# EAGLE design MotorDriver1 (EAGLE 9.0.1)
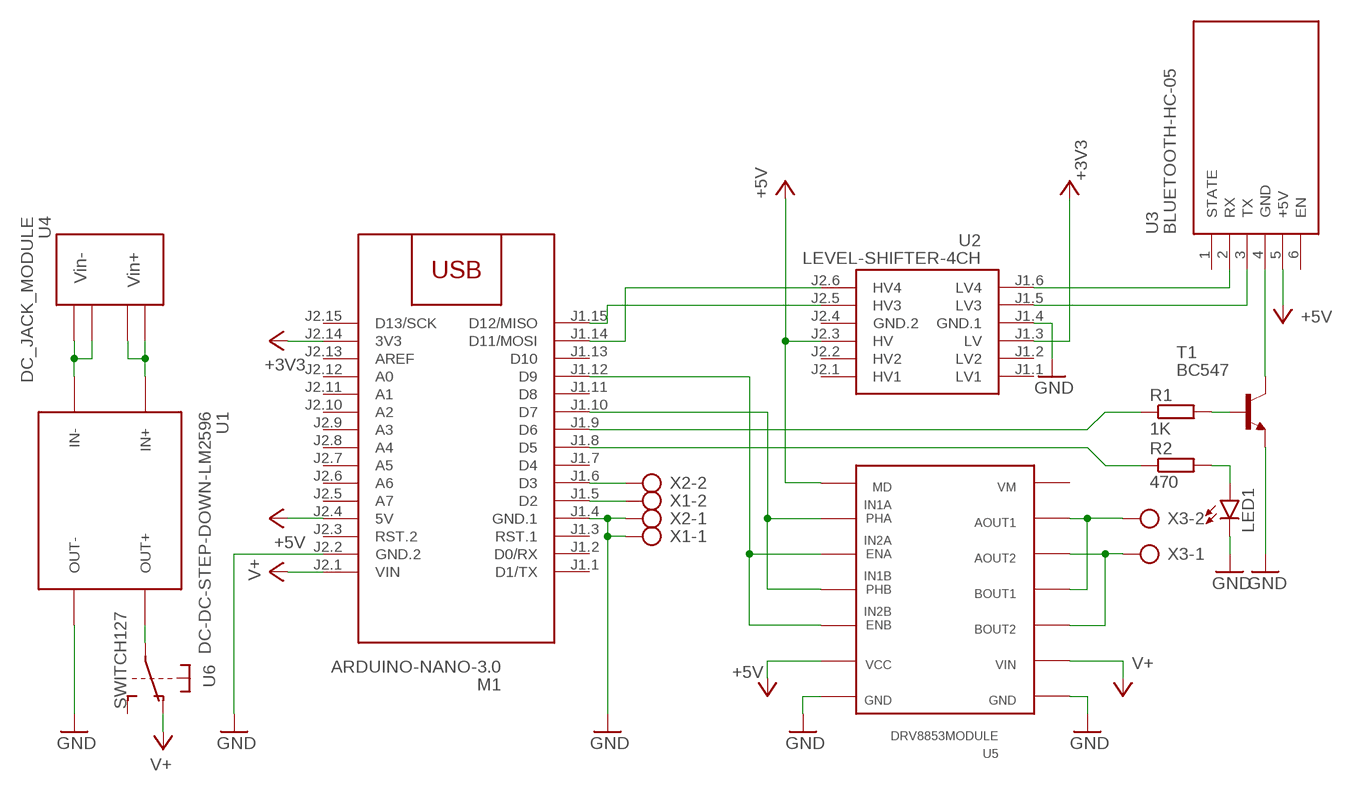
[diagram p0: schematic, sheet 1]

## Parts
LED1  LED3MM  [LED3MM]
M1  ARDUINO-NANO-3.0  [ARDUINO-NANO-3.0]
R1  1K  R-EU_0207/7  [0207/7]
R2  470  R-EU_0207/7  [0207/7]
T1  BC547  [TO92]
U1  DC-DC-STEP-DOWN-LM2596  [DC-DC-STEP-DOWN-LM2596]
U2  LEVEL-SHIFTER-4CH  [LEVEL-SHIFTER-4CH]
U3  BLUETOOTH-HC-05  WIRELESS-BLUETOOTH-HC-05  [WIRELESS-BLUETOOTH-HC-05]
U4  DC_JACK_MODULE  [MA04-1]
U5  DRV8853MODULE  [DIL14]
U6  SWITCH127  [SWITCH127]
X1  AK500/2  [AK500/2]
X2  AK500/2  [AK500/2]
X3  AK500/2  [AK500/2]

## Nets
+3V3: M1.J2.14(3V3) U2.J1.3(LV)
+5V: M1.J2.4(5V) U2.J2.3(HV) U3.5(+5V) U5.9 U5.14
GND: LED1.K(C) M1.J1.4(GND.1) M1.J2.2(GND.2) T1.1(E) U1.OUT- U2.J1.4(GND.1) U5.1 U5.8 X1.1 X2.1
N$1: U1.IN+ U4.1 U4.2
N$2: U1.IN- U4.3 U4.4
N$3: M1.J1.6(D3) X2.2
N$4: M1.J1.10(D7) U5.11 U5.13
N$5: M1.J1.12(D9) U5.10 U5.12
N$6: U5.4 U5.6 X3.2
N$7: M1.J1.5(D2) X1.2
N$8: U1.OUT+ U6.P$2
N$9: M1.J1.8(D5) R2.1
N$10: M1.J1.14(D11/MOSI) U2.J2.6(HV4)
N$11: M1.J1.15(D12/MISO) U2.J2.5(HV3)
N$12: M1.J1.9(D6) R1.1
N$13: U5.3 U5.5 X3.1
N$16: R1.2 T1.2(B)
N$17: T1.3(C) U3.4(GND)
N$19: LED1.A R2.2
N$20: U2.J1.6(LV4) U3.2(RX)
N$22: U2.J1.5(LV3) U3.3(TX)
V+: M1.J2.1(VIN) U5.2 U6.P$3
Unconnected: M1.J1.1(D1/TX) M1.J1.2(D0/RX) M1.J1.3(RST.1) M1.J1.7(D4) M1.J1.11(D8) M1.J1.13(D10) M1.J2.3(RST.2) M1.J2.5(A7) M1.J2.6(A6) M1.J2.7(A5) M1.J2.8(A4) M1.J2.9(A3) M1.J2.10(A2) M1.J2.11(A1) M1.J2.12(A0) M1.J2.13(AREF) M1.J2.15(D13/SCK) U2.J1.1(LV1) U2.J1.2(LV2) U2.J2.1(HV1) U2.J2.2(HV2) U3.1(STATE) U3.6(EN) U5.7 U6.P$1

## Power pins joined to a net without a drawn wire
GND.2: U2.J2.4(GND.2)

## Library data of the parts
LED1 = led:LED: LED OSRAM: - CHIPLED LG R971, LG N971, LY N971, LG Q971, LY Q971, LO R971, LY R971 LH N974, LH R974 LS Q976, LO Q976, LY Q976 LO Q996 - Hyper CHIPLED LW Q18S LB Q993, LB Q99A, LB R99A - SideLED LS A670, LO A670, LY A670, LG A670, LP A670 LB A673, LV A673, LT A673, LW A673 LH A674 LY A675 LS A676, LA A676, LO A676, LY A676, LW A676 LS A679, LY A679, LG A679 - Hyper Micro SIDELED® LS Y876, LA Y876, LO Y876, LY Y876 LT Y87S - SmartLED LW L88C, LW L88S LB L89C, LB L89S, LG L890 LS L89K, LO L89K, LY L89K LS L896, LA L896, LO L896, LY L896 - TOPLED LS T670, LO T670, LY T670, LG T670, LP T670 LSG T670, LSP T670, LSY T670, LOP T670, LYG T670 LG T671, LOG T671, LSG T671 LB T673, LV T673, LT T673, LW T673 LH T674 LS T676, LA T676, LO T676, LY T676, LB T676, LH T676, LSB T676, LW T676 LB T67C, LV T67C, LT T67C, LS T67K, LO T67K, LY T67K, LW E67C LS E67B, LA E67B, LO E67B, LY E67B, LB E67C, LV E67C, LT E67C LW T67C LS T679, LY T679, LG T679 LS T770, LO T770, LY T770, LG T770, LP T770 LB T773, LV T773, LT T773, LW T773 LH T774 LS E675, LA E675, LY E675, LS T675 LS T776, LA T776, LO T776, LY T776, LB T776 LHGB T686 LT T68C, LB T68C - Hyper Mini TOPLED® LB M676 - Mini TOPLED Santana® LG M470 LS M47K, LO M47K, LY M47K Source: http://www.osram.convergy.de LUXEON: - LUMILED® LXK2-PW12-R00, LXK2-PW12-S00, LXK2-PW14-U00, LXK2-PW14-V00 LXK2-PM12-R00, LXK2-PM12-S00, LXK2-PM14-U00 LXK2-PE12-Q00, LXK2-PE12-R00, LXK2-PE12-S00, LXK2-PE14-T00, LXK2-PE14-U00 LXK2-PB12-K00, LXK2-PB12-L00, LXK2-PB12-M00, LXK2-PB14-N00, LXK2-PB14-P00, LXK2-PB14-Q00 LXK2-PR12-L00, LXK2-PR12-M00, LXK2-PR14-Q00, LXK2-PR14-R00 LXK2-PD12-Q00, LXK2-PD12-R00, LXK2-PD12-S00 LXK2-PH12-R00, LXK2-PH12-S00 LXK2-PL12-P00, LXK2-PL12-Q00, LXK2-PL12-R00 Source: www.luxeon.com KINGBRIGHT: KA-3528ASYC Source: www.kingbright.com
M1 = diy-modules:ARDUINO-NANO-3.0: Arduino Nano 3.0 and compatible devices More details available here: https://www.arduino.cc/en/Main/ArduinoBoardNano Click here to find device on ebay.com <http://www.ebay.com/sch/arduino+nano>
R1 R2 = rcl:R-EU_: RESISTOR, European symbol; SPICEPREFIX: R
T1 = transistor:BC547: NPN TRANSISTOR
U1 = diy-modules:DC-DC-STEP-DOWN-LM2596: DC/DC Step-Down Regulator based on LM2596-ADJ chip LM2596 datasheet available here: http://www.ti.com/lit/ds/symlink/lm2596.pdf Click here to find device on ebay.com <http://www.ebay.com/sch/lm2596+power+regulator>
U2 = diy-modules:LEVEL-SHIFTER-4CH: 4-Channel Bi-Directional Logic Level Converter based on BSS128 transistors Click here to find device on ebay.com <http://www.ebay.com/sch/i2c+logic+converter+module>
U3 = diy-modules:WIRELESS-BLUETOOTH-HC-05: Bluetooth Transceiver Module based on HC-05 board Tutorial is available here: https://arduino-info.wikispaces.com/BlueTooth-HC05-HC06-Modules-How-To Click here to find device on ebay.com <http://www.ebay.com/sch/hc-05+module+rs232>
U4 = lib_2:DC_JACK_MODULE
U5 = lib_2:DRV8853MODULE
U6 = lib_2:SWITCH127
X1-X3 = con-ptr500:AK500/2: CONNECTOR; OC_FARNELL: unknown; OC_NEWARK: unknown

## Board
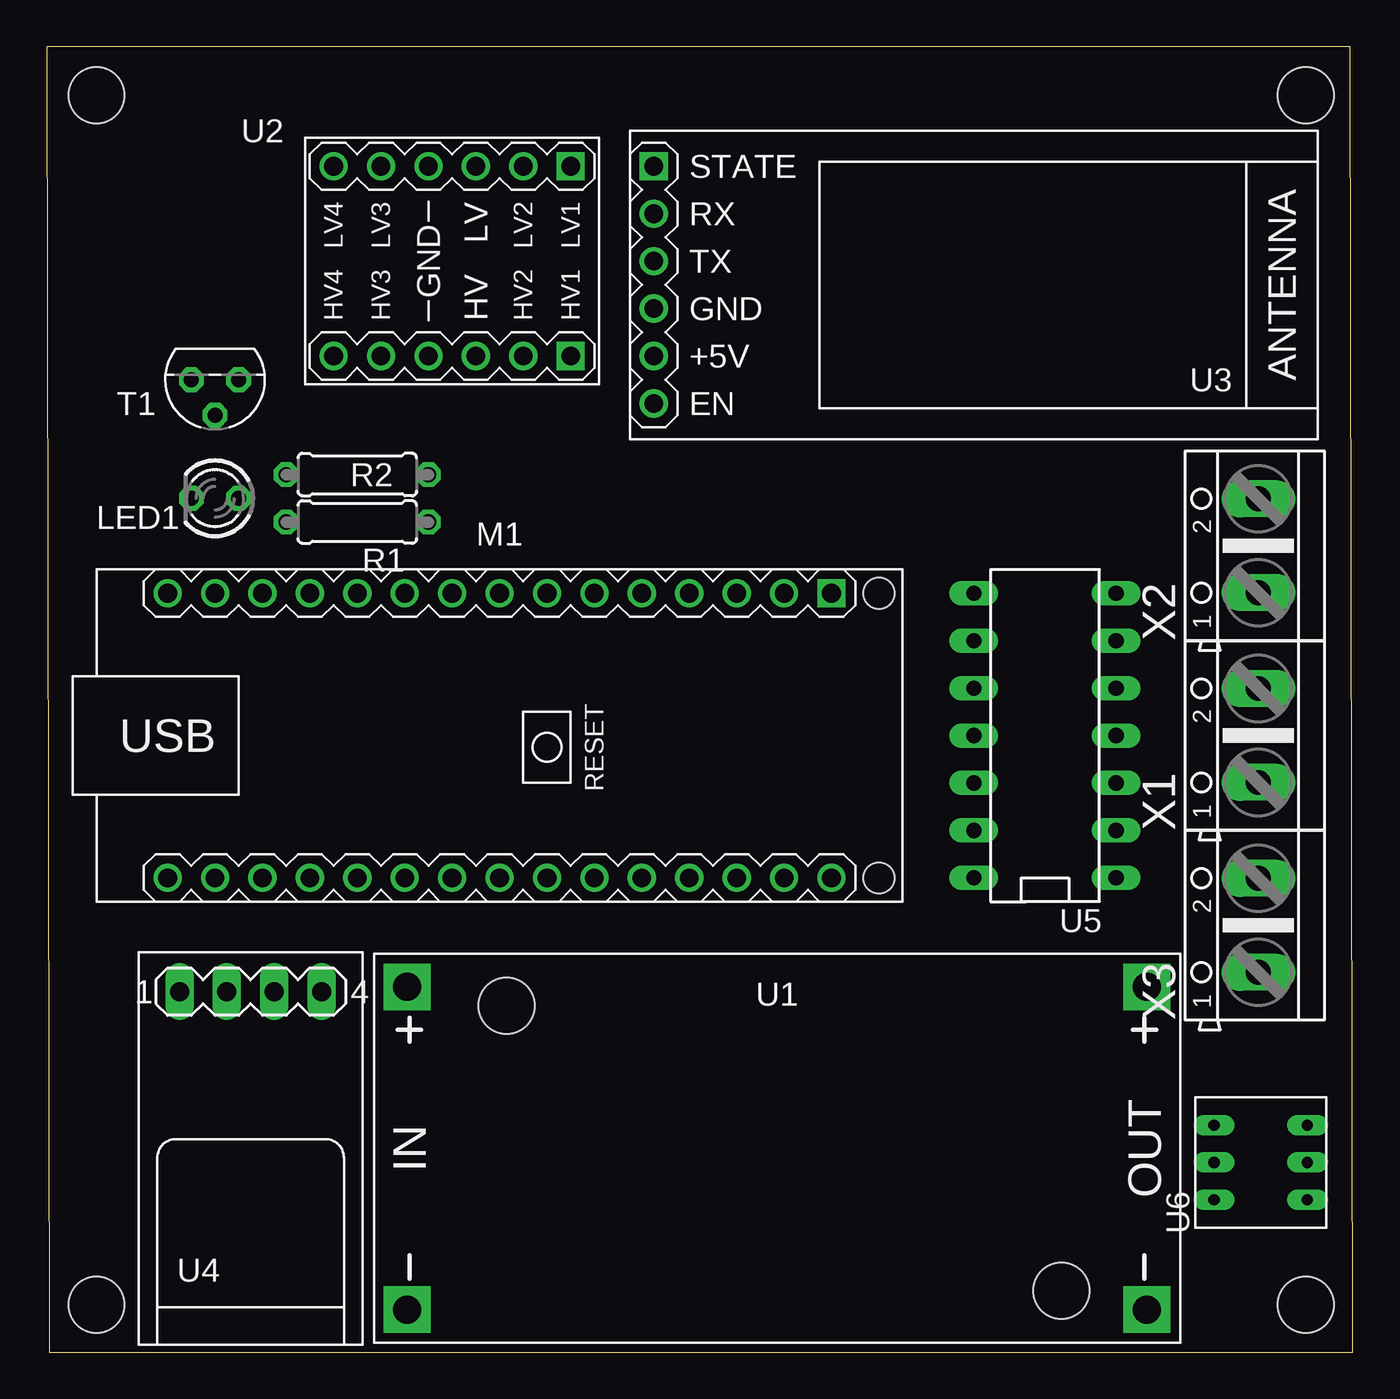
[diagram p1: board, top side]
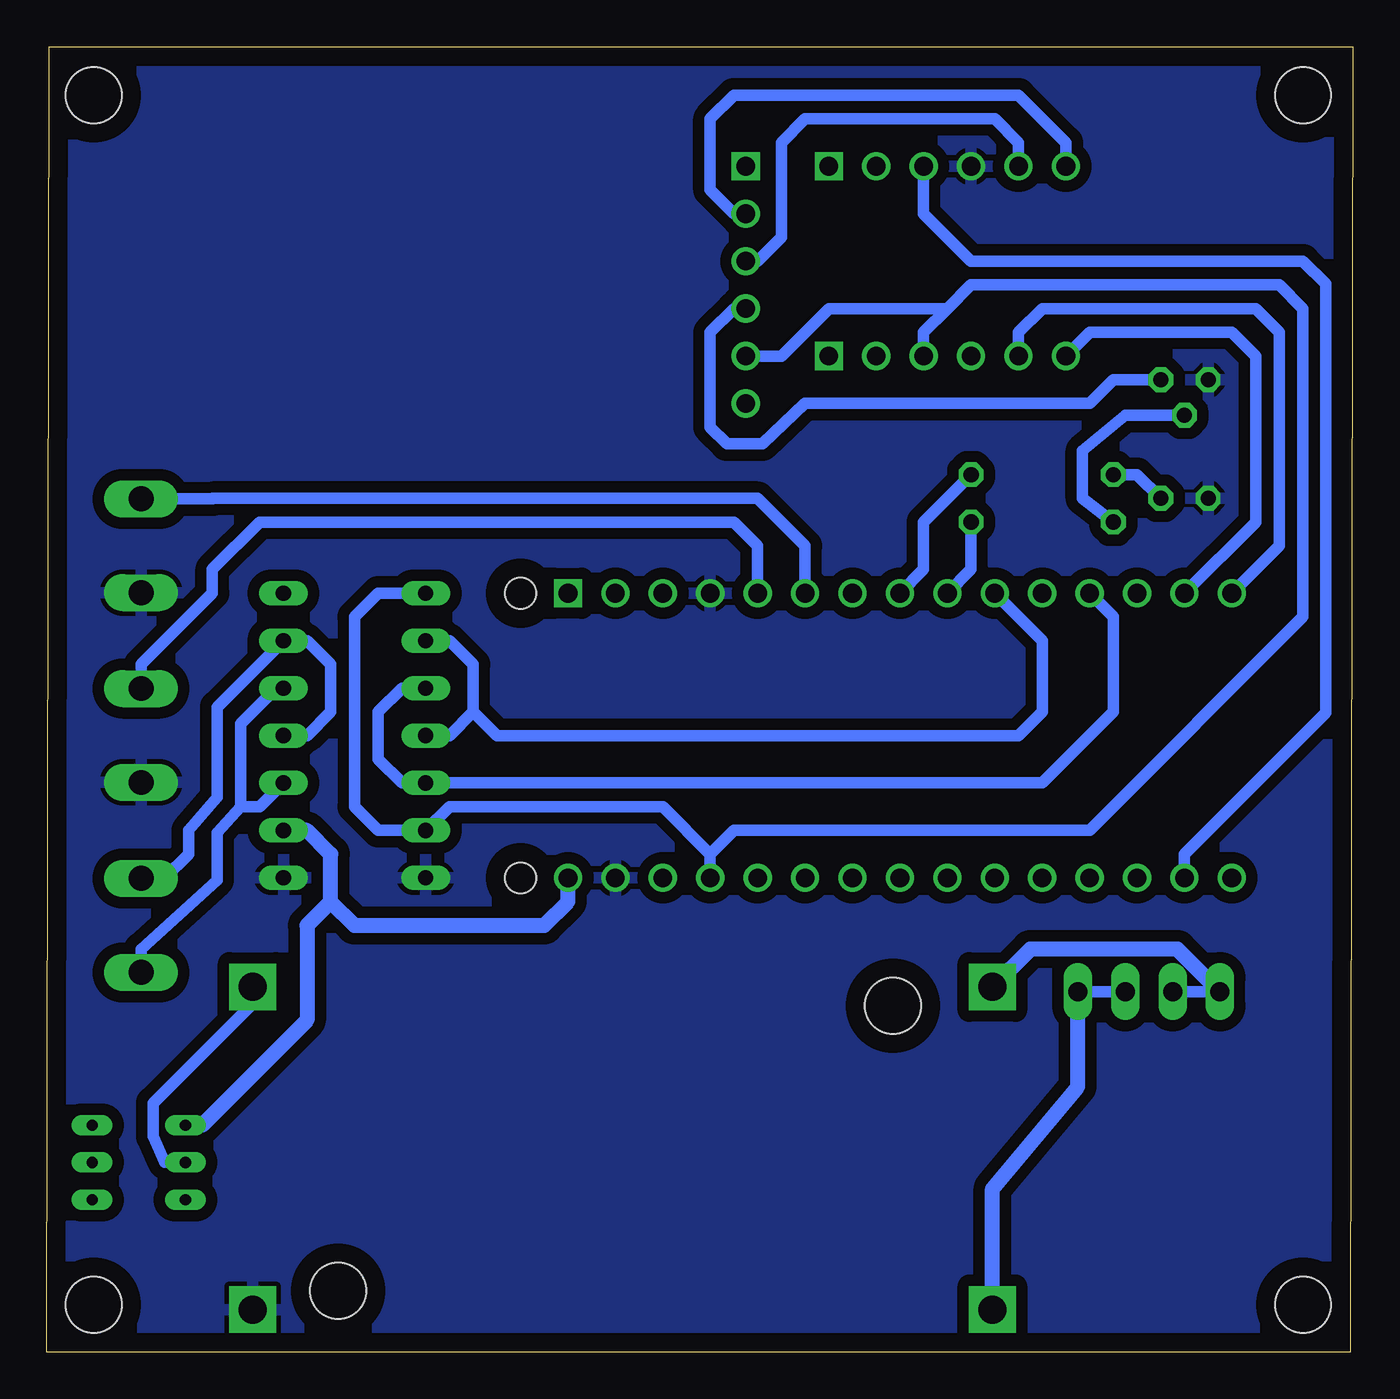
[diagram p2: board, bottom side, seen from below]

Size 69.96 x 69.9 mm. Coordinates in mm from the lower left corner, seen from the top.
Outline: 0.13,0 69.96,0 69.83,69.9 0,69.9 0.13,0
Copper layers (1*16): Top 0.035mm / dielectric 1.5mm / Bottom 0.035mm
Design rules "default": minimum track width 6mil, minimum drill 0.35mm, track to track 6mil, track to pad 6mil, pad to pad 6mil, via to via 6mil, smd to smd 6mil, copper to edge 40mil, drill to drill 6mil, minimum pad ring 10mil, minimum via ring 8mil, stop-mask expansion 4mil, vias tented up to drill 0mil, thermal gap 10mil
Holes 3 mm at 2.67,67.31 67.44,67.31 67.44,2.54 2.67,2.54

### Footprints (pad centres in the part's own frame; a part is rotated, then mirrored left to right if it is on the bottom)
LED3MM = drill 0.813 octagon: A -1.27,0; K 1.27,0
ARDUINO-NANO-3.0 = drill 1 square: J1.1 17.78,7.62 | drill 1: J1.2 15.24,7.62; J1.3 12.7,7.62; J1.4 10.16,7.62; J1.5 7.62,7.62; J1.6 5.08,7.62; J1.7 2.54,7.62; J1.8 0,7.62; J1.9 -2.54,7.62; J1.10 -5.08,7.62; J1.11 -7.62,7.62; J1.12 -10.16,7.62; J1.13 -12.7,7.62; J1.14 -15.24,7.62; J1.15 -17.78,7.62; J2.1 17.78,-7.62; J2.2 15.24,-7.62; J2.3 12.7,-7.62; J2.4 10.16,-7.62; J2.5 7.62,-7.62; J2.6 5.08,-7.62; J2.7 2.54,-7.62; J2.8 0,-7.62; J2.9 -2.54,-7.62; J2.10 -5.08,-7.62; J2.11 -7.62,-7.62; J2.12 -10.16,-7.62; J2.13 -12.7,-7.62; J2.14 -15.24,-7.62; J2.15 -17.78,-7.62 | hole 1.651: 20.32,-7.62; 20.32,7.62
0207/7 = drill 0.813 octagon: 1 -3.81,0; 2 3.81,0
TO92 = drill 0.813 octagon: 1 1.27,0; 2 0,1.905; 3 -1.27,0
DC-DC-STEP-DOWN-LM2596 = drill 1.5 pad 2.5 square: IN+ -19.812,8.636; IN- -19.812,-8.636; OUT+ 19.812,8.636; OUT- 19.812,-8.636 | hole 3: -14.478,7.62; 15.24,-7.62
LEVEL-SHIFTER-4CH = drill 1 square: J1.1 -5.08,6.35; J2.1 5.08,6.35 | drill 1: J1.2 -5.08,3.81; J1.3 -5.08,1.27; J1.4 -5.08,-1.27; J1.5 -5.08,-3.81; J1.6 -5.08,-6.35; J2.2 5.08,3.81; J2.3 5.08,1.27; J2.4 5.08,-1.27; J2.5 5.08,-3.81; J2.6 5.08,-6.35
WIRELESS-BLUETOOTH-HC-05 = drill 1 square: 1 -6.35,-17.145 | drill 1: 2 -3.81,-17.145; 3 -1.27,-17.145; 4 1.27,-17.145; 5 3.81,-17.145; 6 6.35,-17.145
MA04-1 = drill 1.016 long: 1 -3.81,8.89; 2 -1.27,8.89; 3 1.27,8.89; 4 3.81,8.89
DIL14 = drill 0.813 long: 1 -7.62,-3.81; 2 -5.08,-3.81; 3 -2.54,-3.81; 4 0,-3.81; 5 2.54,-3.81; 6 5.08,-3.81; 7 7.62,-3.81; 8 -7.62,3.81; 9 -5.08,3.81; 10 -2.54,3.81; 11 0,3.81; 12 2.54,3.81; 13 5.08,3.81; 14 7.62,3.81
SWITCH127 = drill 0.6 long: P$1 -2,2.5; P$2 0,2.5; P$3 2,2.5; P$4 -2,-2.5; P$5 0,-2.5; P$6 2,-2.5
AK500/2 = drill 1.321 long: 1 -2.515,0; 2 2.515,0

### Placement (x,y rotation side)
LED1  9.02,45.72 180 top
M1  24.26,33.02 0 top
R1  16.64,44.45 180 top
R2  16.64,46.99 180 top
T1  9.02,52.07 180 top
U1  39.12,10.92 0 top
U2  21.72,58.42 270 top
U3  49.66,57.15 270 top
U4  10.92,10.41 0 top
U5  53.47,33.02 90 top
U6  65.02,10.16 90 top
X1  64.9,33.02 90 top
X2  64.9,43.18 90 top
X3  64.9,22.86 90 top

### Tracks (layer width: path | path; a pad name or v marks a point on that pad's centre or on a via)
+3V3
  Bottom 0.61: M1.J2.14 9.02,26.67 1.45,34.24 1.45,57.2 2.67,58.42 20.45,58.42 22.99,60.96 U2.J1.3
+5V
  Bottom 0.61: M1.J2.4 34.42,26.67 | 34.42,26.67 33.15,27.94 14.1,27.94 2.67,39.37 2.67,55.88 3.94,57.15 20.45,57.15 21.72,55.88 | 21.72,55.88 28.07,55.88 30.61,53.34 U3.5 | U2.J2.3 22.99,54.61 21.72,55.88 | U5.14 52.2,40.64 53.47,39.37 53.47,29.21 52.2,27.94 U5.9 48.39,29.21 36.96,29.21 34.42,26.67
GND
  pour Bottom (isolate 0.61): -2.41,71.12 73.79,71.12 73.79,-2.54 -2.41,-2.54
N$1
  Bottom 0.61: U4.1 U4.2
  Bottom 0.813: U4.1 9.4,21.59 17.27,21.59 U1.IN+
N$2
  Bottom 0.61: U4.3 U4.4
  Bottom 0.813: U4.4 14.73,14.22 19.3,8.76 U1.IN-
N$3
  Bottom 0.61: X2.2 61.09,45.7 | 61.09,45.7 61.06,45.7 | M1.J1.6 29.34,43.18 31.88,45.72 61.06,45.72 61.09,45.7
N$4
  Bottom 0.61: U5.11 48.39,33.02 47.12,34.29 | 47.12,34.29 47.12,36.83 48.39,38.1 U5.13 | 47.12,34.29 45.85,33.02 17.91,33.02 16.64,34.29 16.64,38.1 M1.J1.10
N$5
  Bottom 0.61: U5.12 50.93,35.56 52.2,34.29 52.2,31.75 50.93,30.48 U5.10 16.64,30.48 12.83,34.29 12.83,39.37 M1.J1.12
N$6
  Bottom 0.61: U5.4 56.01,33.02 54.74,34.29 54.74,36.83 56.01,38.1 U5.6 | X3.2 64.87,25.4 63.63,25.4 62.36,26.67 62.36,27.94 60.83,29.72 60.83,34.54 U5.6 | U5.6 57.79,38.1
N$7
  Bottom 0.61: X1.2 64.9,36.83 61.09,40.64 61.09,41.91 58.55,44.45 33.15,44.45 31.88,43.18 M1.J1.5
N$8
  Bottom 0.61: U6.P$2 63.63,10.16 64.26,11.56 64.26,12.7 64.26,12.83 64.26,13.34 58.93,18.67 U1.OUT+
N$9
  Bottom 0.61: M1.J1.8 22.99,41.91 22.99,44.45 R2.1
N$10
  Bottom 0.61: U2.J2.6 14.1,54.61 6.48,54.61 5.21,53.34 5.21,44.45 M1.J1.14
N$11
  Bottom 0.61: U2.J2.5 17.91,54.61 16.64,55.88 5.21,55.88 3.94,54.61 3.94,43.18 M1.J1.15
N$12
  Bottom 0.61: M1.J1.9 20.45,41.91 R1.1
N$13
  Bottom 0.61: U5.3 58.55,29.21 59.56,29.21 | 59.56,29.21 60.83,27.81 60.83,25.27 64.9,21.59 X3.1 | 59.56,29.21 59.56,33.66 57.66,35.56 U5.5
N$16
  Bottom 0.61: T1.2 12.19,50.16 14.48,48.26 14.48,45.72 R1.2
N$17
  Bottom 0.61: T1.3 12.83,52.07 14.1,50.8 29.34,50.8 31.62,48.64 33.53,48.64 34.42,49.53 34.42,54.61 33.15,55.88 U3.4
N$19
  Bottom 0.61: R2.2 11.56,46.99 LED1.A
N$20
  Bottom 0.61: U2.J1.6 15.37,64.77 17.91,67.31 33.15,67.31 34.42,66.04 34.42,62.23 33.15,60.96 U3.2
N$22
  Bottom 0.61: U2.J1.5 17.91,64.77 19.18,66.04 29.34,66.04 30.61,64.77 30.61,59.69 31.88,58.42 U3.3
V+
  Bottom 0.813: U5.2 56.01,27.94 54.74,26.67 54.74,24.13 | 54.74,24.13 56.01,22.86 56.01,17.78 61.63,12.16 U6.P$3 | 54.74,24.13 53.47,22.86 43.31,22.86 42.04,24.13 M1.J2.1